# EAGLE schematic ERobot Minimalis - 2023 (EAGLE 9.6.2)
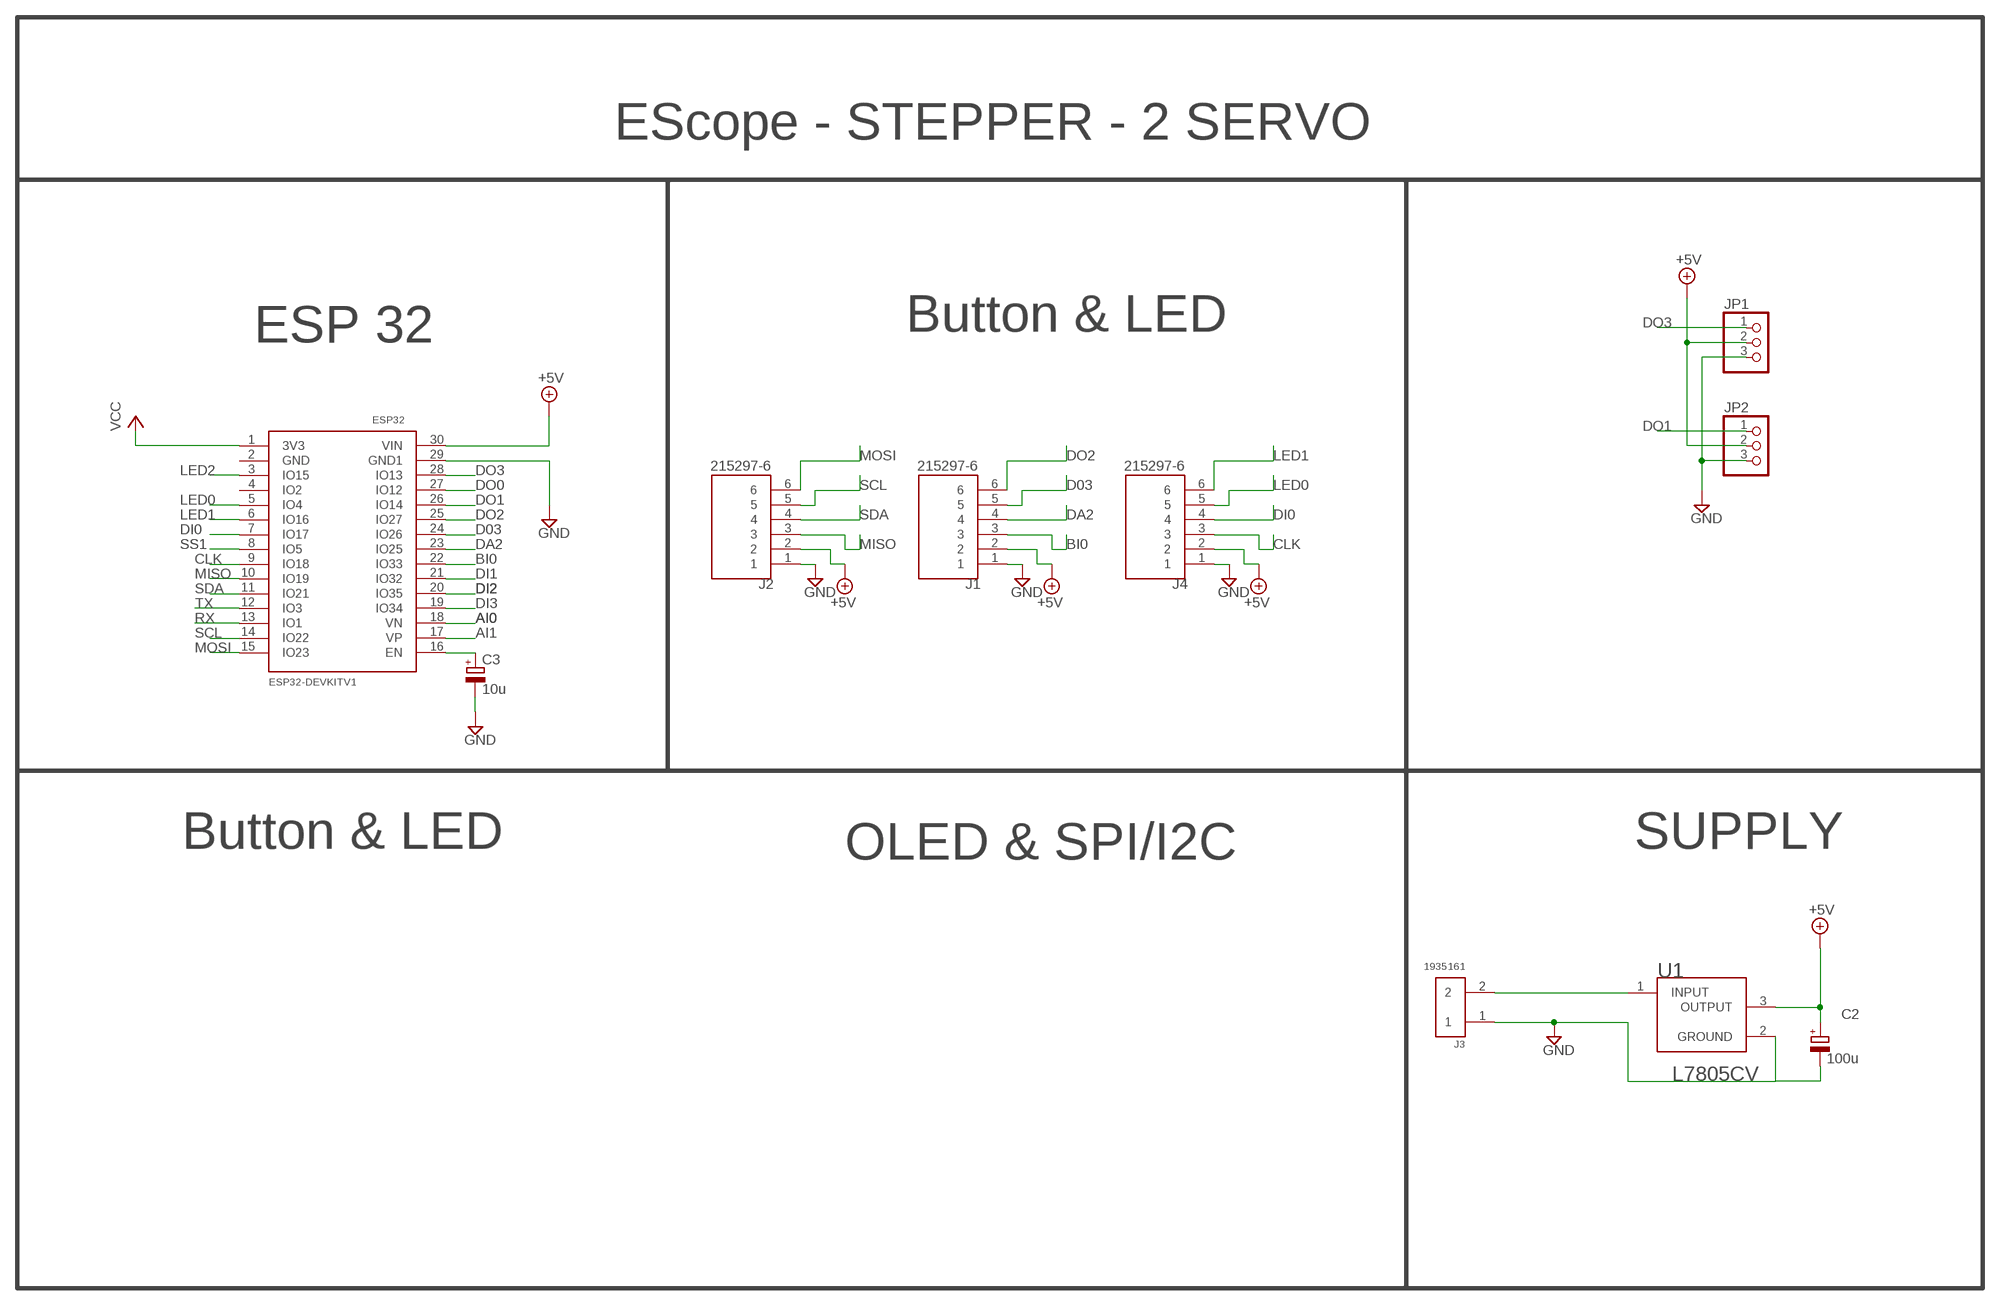
[diagram p0: schematic, sheet 1]

## Parts
C2  100u  CPOL-EUE3.5-8  [E3,5-8]
C3  10u  CPOL-EUE2.5-5  [E2,5-5]
ESP32  DEVKIT-V1  ESP32DEVKITV1  [ESP32-DEVKITV1]
J1  215297-6  [TE_215297-6]
J2  215297-6  [TE_215297-6]
J3  1935161  [PHOENIX_1935161]
J4  215297-6  [TE_215297-6]
JP1  PINHD-1X3  [1X03]
JP2  PINHD-1X3  [1X03]
U1  STMICROELECTRONICS_L7805CVSTMICROELECTRONICS_L7805CV_0_0  [STMICROELECTRONICS_L7805CV_0]

## Nets
+5V: C2.+ ESP32.30(VIN) J1.2 J2.2 J4.2 JP1.2 JP2.2 U1.3(OUTPUT)
AI0: ESP32.18(VN)
AI1: ESP32.17(VP)
BI0: ESP32.22(IO33) J1.3
CLK: ESP32.9(IO18) J4.3
D03: ESP32.24(IO26) J1.5
DA2: ESP32.23(IO25) J1.4
DI0: ESP32.7(IO17) J4.4
DI1: ESP32.21(IO32)
DI2: ESP32.20(IO35)
DI3: ESP32.19(IO34)
DO0: ESP32.27(IO12)
DO1: ESP32.26(IO14) JP2.1
DO2: ESP32.25(IO27) J1.6
DO3: ESP32.28(IO13) JP1.1
GND: C2.- C3.- ESP32.29(GND1) J1.1 J2.1 J3.1 J4.1 JP1.3 JP2.3 U1.2(GROUND)
LED0: ESP32.5(IO4) J4.5
LED1: ESP32.6(IO16) J4.6
LED2: ESP32.3(IO15)
MISO: ESP32.10(IO19) J2.3
MOSI: ESP32.15(IO23) J2.6
N$1: J3.2 U1.1(INPUT)
N$4: C3.+ ESP32.16(EN)
RX: ESP32.13(IO1)
SCL: ESP32.14(IO22) J2.5
SDA: ESP32.11(IO21) J2.4
SS1: ESP32.8(IO5)
TX: ESP32.12(IO3)
VCC: ESP32.1(3V3)
Unconnected: ESP32.2(GND) ESP32.4(IO2)

## Notes on the sheet
- EScope - STEPPER - 2 SERVO
- Button & LED
- ESP 32
- Button & LED | SUPPLY
- OLED & SPI/I2C

## Library data of the parts
C2 C3 = rcl:CPOL-EU: POLARIZED CAPACITOR, European symbol; SPICEPREFIX: C
ESP32 = ESP32-DEVKITV1:ESP32DEVKITV1
J1 J2 J4 = 215297-6:215297-6: Check availability <https://pricing.snapeda.com/parts/215297-6/TE%20Connectivity/view-part?ref=eda>; AVAILABILITY: In Stock; COMMENT: 215297-6; DESCRIPTION: Wire-To-Board Connector, Vertical, Ampmodu Hv-100 Series, Through Hole, Receptacle, 6, 2.54 Mm; EU_ROHS_COMPLIANCE: Compliant; MF: TE Connectivity; MP: 215297-6; PACKAGE: None; PRICE: None; PURCHASE-URL: https://pricing.snapeda.com/search/part/215297-6/?ref=eda
J3 = 1935161:1935161: Conn Terminal Blocks 2 POS 5mm Solder ST Thru-Hole 16A Check availability <https://pricing.snapeda.com/parts/1935161/Phoenix%20Contact/view-part?ref=eda>; AVAILABILITY: In Stock; DESCRIPTION: 2 Position Wire to Board Terminal Block Horizontal with Board 0.197 (5.00mm) Through Hole; MF: Phoenix Contact; MP: 1935161; PACKAGE: None; PRICE: None; PURCHASE-URL: https://pricing.snapeda.com/search/part/1935161/?ref=eda
JP1 JP2 = pinhead:PINHD-1X3: PIN HEADER
U1 = STMicroelectronics - L7805CV:STMICROELECTRONICS_L7805CV: Linear Voltage Regulator IC Positive Fixed 1 Output 5V 1.5A TO-220AB; CENTROID_NOT_SPECIFIED: No; DATASHEET: http://www.st.com/content/ccc/resource/technical/document/datasheet/41/4f/b3/b0/12/d4/47/88/CD00000444.pdf/files/CD00000444.pdf/jcr:content/translations/en.CD00000444.pdf; DIGIKEY_DESCRIPTION: IC REG LINEAR 5V 1.5A TO220AB; DIGIKEY_PART_NUMBER: 497-1443-5-ND; IPC_LAND_PATTERN_NAME: TO-220; LEAD_FREE: yes; MF: STMicroelectronics; MFG_PACKAGE_IDENT: TO-220-3; MOUSER_PART_NUMBER: 511-L7805CV; MPN: L7805CV; PACKAGE: TO-220-3; PREFIX: U; ROHS: yes; TEMPERATURE_RANGE_HIGH: +125°C; TEMPERATURE_RANGE_LOW: 0°C